# EAGLE design Maduino Zero SIM868 GPS Tracker v1.1 (EAGLE 6.1)
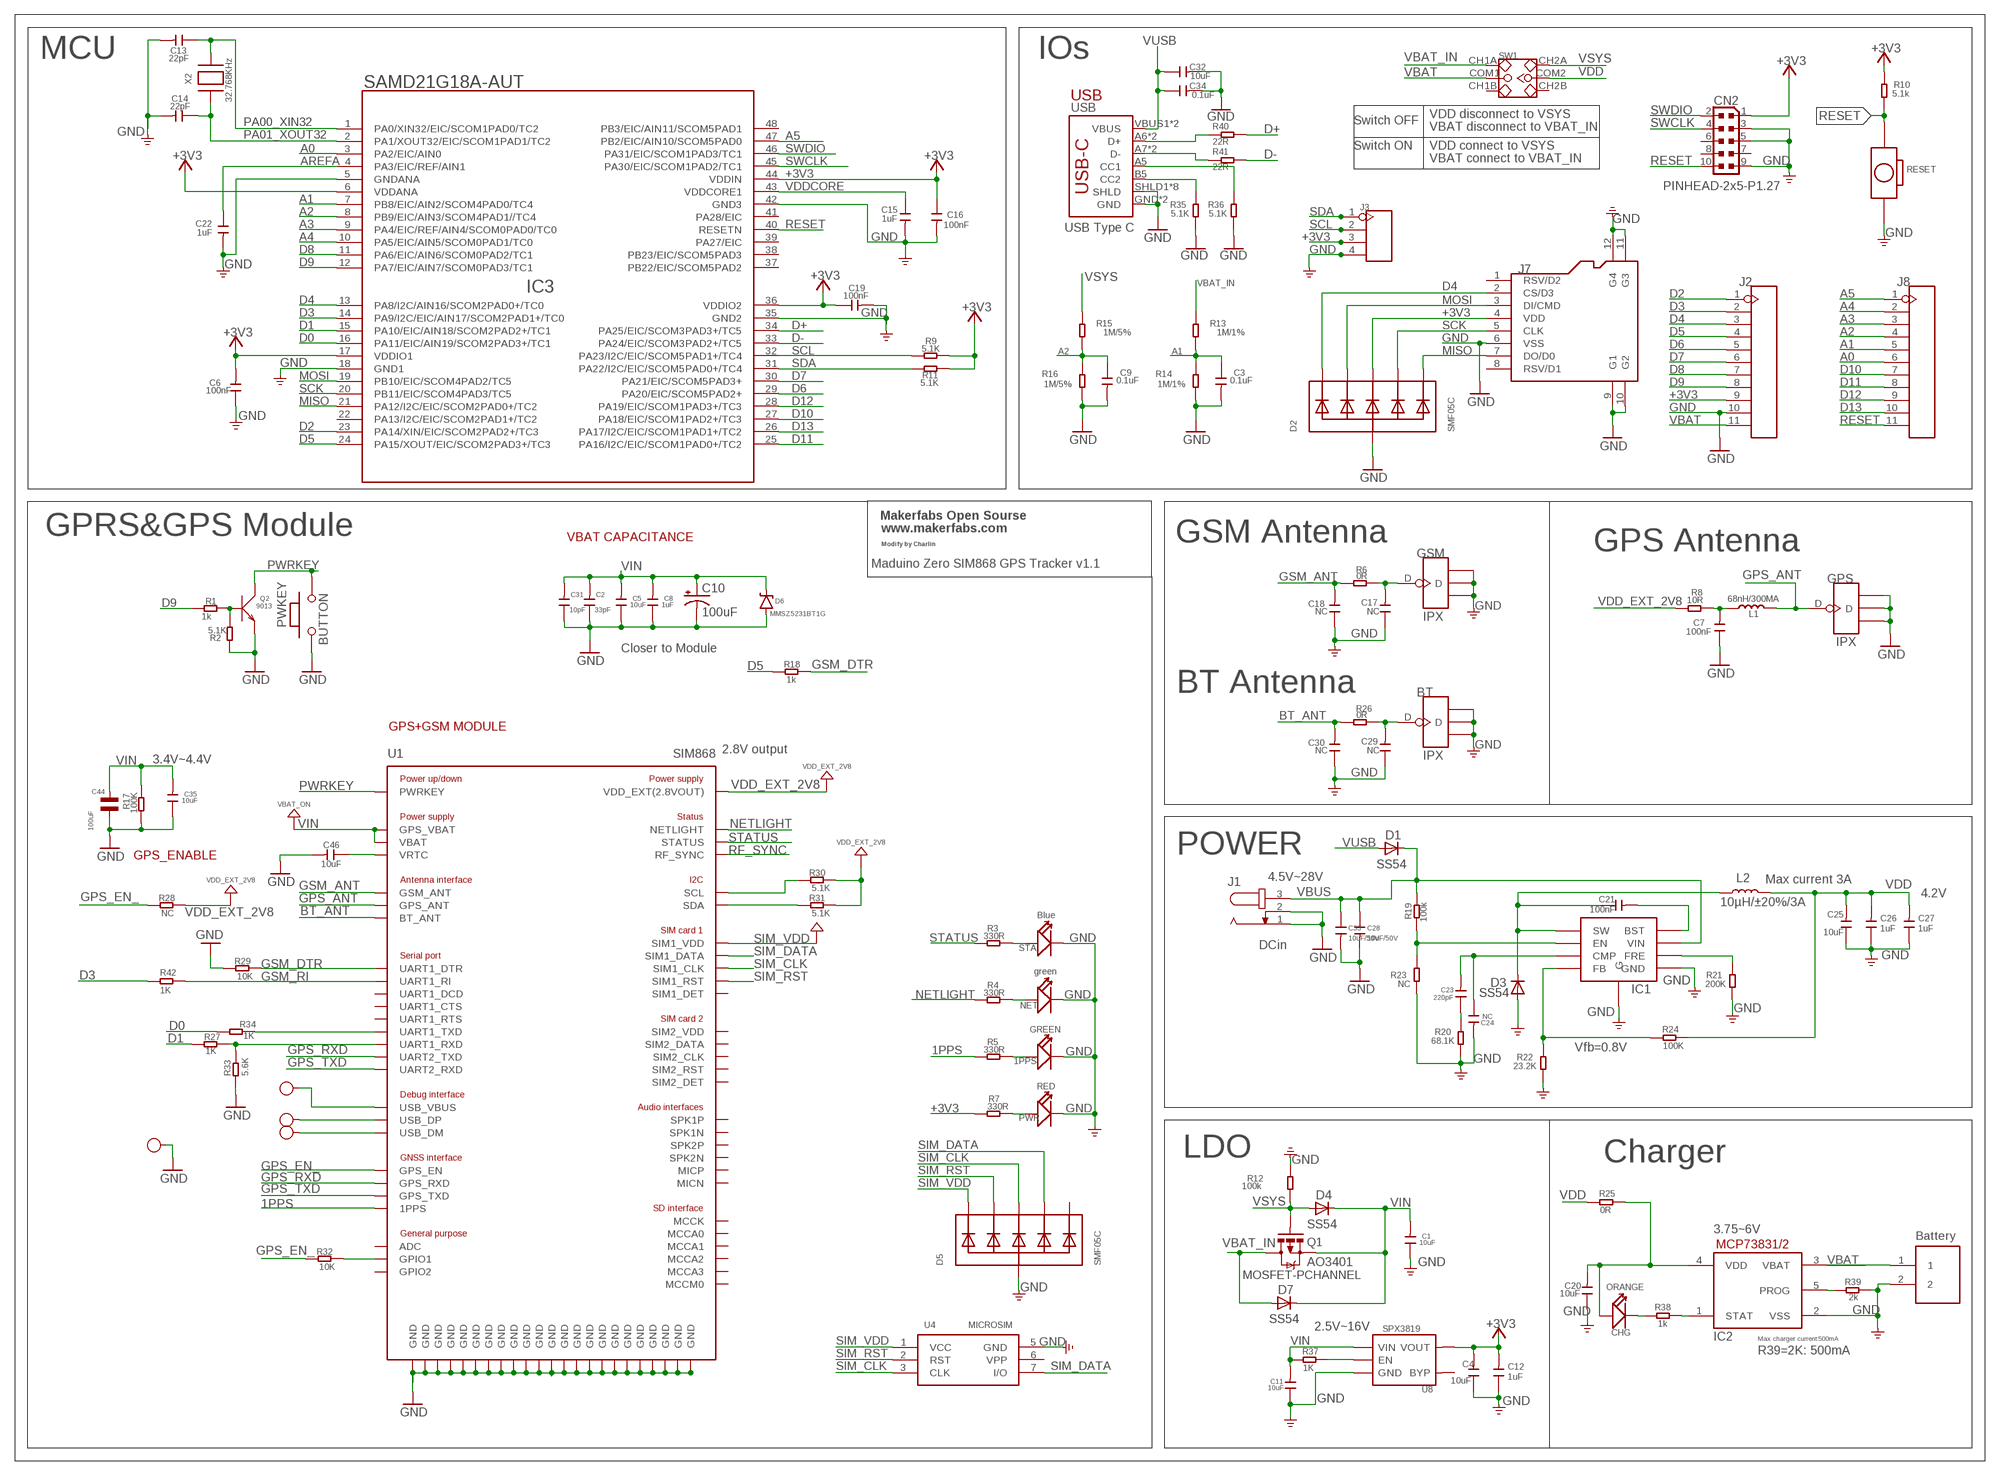
[diagram p0: schematic, sheet 1]

## Parts
1PPS  GREEN  LED'0603'  [LED-0603]
BT  ANTENNA-U-FL  [4P-U-FL]
C1  10uF  C-0603  [0603]
C2  33pF  C-0603  [0603]
C3  0.1uF  C-0603  [0603]
C4  10uF  C-0603  [0603]
C5  10uF  C-0603  [0603]
C6  100nF  C-0603  [0603]
C7  100nF  C-0603  [0603]
C8  1uF  C-0603  [0603]
C9  0.1uF  C-0603  [0603]
C10  100uF  68UF-POLAR-EIA3528-10V-10%(TANT)  [EIA3528]
C11  10uF  C-0603  [0603]
C12  1uF  C-0603  [0603]
C13  22pF  C-0603  [0603]
C14  22pF  C-0603  [0603]
C15  1uF  C-0603  [0603]
C16  100nF  C-0603  [0603]
C17  NC  C-0402  [0402]
C18  NC  C-0402  [0402]
C19  100nF  C-0603  [0603]
C20  10uF  C-0603  [0603]
C21  100nF  C-0603  [0603]
C22  1uF  C-0603  [0603]
C23  220pF  C-0603  [0603]
C24  NC  C-0603  [0603]
C25  10uF  C-0603  [0603]
C26  1uF  C-0603  [0603]
C27  1uF  C-0603  [0603]
C28  10uF/50V  C-0603  [0603]
C29  NC  C-0402  [0402]
C30  NC  C-0402  [0402]
C31  10pF  C-0603  [0603]
C32  10uF  C-0603  [0603]
C33  10uF/50V  C-0603  [0603]
C34  0.1uF  C-0603  [0603]
C35  10uF  C-0603  [0603]
C44  100uF  CAPACITOR_NP_1206  [C1206]
C46  10uF  C-0805  [0805]
CHG  ORANGE  007-LED0603  [D0603]
CN2  PINHEAD-2x5-P1.27  0171_PH127-205DF055G00AROUND-PADS  [PINHEAD_2X05_127]
D1  SS54  DIODE-DO-214AC  [DO-214AC]
D2  SMF05C  TVSARRAY_5LANE  [SOT363]
D3  SS54  DIODE-DO-214AC  [DO-214AC]
D4  SS54  DIODE-DO-214AC  [DO-214AC]
D5  SMF05C  TVSARRAY_5LANE  [SOT363]
D6  MMSZ5231BT1G  [SOD-123]
D7  SS54  DIODE-DO-214AC  [DO-214AC]
DN  TEST-POINT'4545'  [TP-D45MIL]
DP  TEST-POINT'4545'  [TP-D45MIL]
GND20  TEST-POINT'4545'  [TP-D45MIL]
GPS  ANTENNA-U-FL  [4P-U-FL]
GSM  ANTENNA-U-FL  [4P-U-FL]
IC1  MP1584  [SOIC8E]
IC2  MCP73831/OT  [SOT23-5L]
IC3  SAMD21G18A-AUT  ATSAMD21G18A-AUT  [TQFP48-7X7]
J1  JACK-PLUG1  [SPC4078]
J2  HEADER-11P-2.54  [11P-2.54]
J3  HEADER-4P-60/35MILROUND  [4P-65/35ROUND]
J6  PH2.0-2P-90-DIP  [PH2.0-2P-90-DIP]
J7  HOLDER-MICROSD-8P  [8P-SMD]
J8  HEADER-11P-2.54  [11P-2.54]
L1  68nH/300MA  L'0603'  [L0603]
L2  10µH/±20%/3A  INDUCTOR-SRN6045-33UH  [SRN6045]
NET  green  LED'0603'  [LED-0603]
PWKEY  BUTTON  PB157  [157SW]
PWR  RED  LED'0603'  [LED-0603]
Q1  MOSFET-PCHANNEL  [SOT23-3]
Q2  9013  TRANSISTOR-NPN-SOT23  [SOT23]
R1  1k  R-0603  [R0603]
R2  5.1K  R-0603  [R0603]
R3  330R  R-0603  [R0603]
R4  330R  R-0603  [R0603]
R5  330R  R-0603  [R0603]
R6  0R  R-0603  [R0603]
R7  330R  R-0603  [R0603]
R8  10R  R-0603  [R0603]
R9  5.1K  R-0603  [R0603]
R10  5.1k  R-0603  [R0603]
R11  5.1K  R-0603  [R0603]
R12  100k  R-0603  [R0603]
R13  1M/1%  R-0603  [R0603]
R14  1M/1%  R-0603  [R0603]
R15  1M/5%  R-0603  [R0603]
R16  1M/5%  R-0603  [R0603]
R17  100K  R-0603  [R0603]
R18  1k  R-0603  [R0603]
R19  100k  R-0603  [R0603]
R20  68.1K  R-0603  [R0603]
R21  200K  R-0603  [R0603]
R22  23.2K  R-0603  [R0603]
R23  NC  R-0603  [R0603]
R24  100K  R-0603  [R0603]
R25  0R  R-0603  [R0603]
R26  0R  R-0603  [R0603]
R27  1K  R-0603  [R0603]
R28  NC  R-0603  [R0603]
R29  10K  R-0603  [R0603]
R30  5.1K  R-0603  [R0603]
R31  5.1K  R-0603  [R0603]
R32  10K  R-0603  [R0603]
R33  5.6K  R-0603  [R0603]
R34  1K  R-0603  [R0603]
R35  5.1K  R-0603  [R0603]
R36  5.1K  R-0603  [R0603]
R37  1K  R-0603  [R0603]
R38  1k  R-0603  [R0603]
R39  2k  R-0603  [R0603]
R40  22R  R-0603  [R0603]
R41  22R  R-0603  [R0603]
R42  1K  R-0603  [R0603]
RESET  BOTTON-2P-90D  [2P-7.62X3.56-90D]
STA  Blue  LED'0603'  [LED-0603]
SW1  SWITCH-2CH-6P  [6P-2CH-2.54-7.6X3.0]
U1  SIM868  [SIM868]
U4  MICROSIM  [MICROSIM]
U8  SPX3819  [SOT23-5]
USB  USB_C5  [USB-C-16P-5]
VUSB  TEST-POINT'4545'  [TP-D45MIL]
X2  32.768KHz  XTAL-3.2X1.5  [XTAL3215]

## Nets
1PPS: R5.1 U1.60_(1PPS)
+3V3: C4.2 C6.2 C12.2 C16.1 C19.1 CN2.1 D2.4(C3) IC3.6(VDDANA) IC3.17(VDDIO1) IC3.36(VDDIO2) IC3.44(VDDIN) J2.9 J3.3 J7.4(VDD) R7.1 R9.2 R10.2 R11.2 U8.5(VOUT)
A0: IC3.3(PA2/EIC/AIN0) J8.6
A1: C3.1 IC3.7(PB8/EIC/AIN2/SCOM4PAD0/TC4) J8.5 R13.1 R14.2
A2: C9.1 IC3.8(PB9/EIC/AIN3/SCOM4PAD1//TC4) J8.4 R15.1 R16.2
A3: IC3.9(PA4/EIC/REF/AIN4/SCOM0PAD0/TC0) J8.3
A4: IC3.10(PA5/EIC/AIN5/SCOM0PAD1/TC0) J8.2
A5: IC3.47(PB2/EIC/AIN10/SCOM5PAD0) J8.1
AREFA: C22.1 IC3.4(PA3/EIC/REF/AIN1)
BT_ANT: C30.2 R26.1 U1.20_(BT_ANT)
D0: IC3.16(PA11/EIC/AIN19/SCOM2PAD3+/TC1) R34.1
D1: IC3.15(PA10/EIC/AIN18/SCOM2PAD2+/TC1) R27.1
D2: IC3.23(PA14/XIN/EIC/SCOM2PAD2+/TC3) J2.1
D3: IC3.14(PA9/I2C/EIC/AIN17/SCOM2PAD1+/TC0) J2.2 R42.1
D4: D2.1(C1) IC3.13(PA8/I2C/AIN16/SCOM2PAD0+/TC0) J2.3 J7.2(CS/D3)
D5: IC3.24(PA15/XOUT/EIC/SCOM2PAD3+/TC3) J2.4 R18.1
D6: IC3.29(PA20/EIC/SCOM5PAD2+) J2.5
D7: IC3.30(PA21/EIC/SCOM5PAD3+) J2.6
D8: IC3.11(PA6/EIC/AIN6/SCOM0PAD2/TC1) J2.7
D9: IC3.12(PA7/EIC/AIN7/SCOM0PAD3/TC1) J2.8 R1.1
D10: IC3.27(PA18/EIC/SCOM1PAD2+/TC3) J8.7
D11: IC3.25(PA16/I2C/EIC/SCOM1PAD0+/TC2) J8.8
D12: IC3.28(PA19/EIC/SCOM1PAD3+/TC3) J8.9
D13: IC3.26(PA17/I2C/EIC/SCOM1PAD1+/TC2) J8.10
D+: IC3.34(PA25/EIC/SCOM3PAD3+/TC5) R40.1
D-: IC3.33(PA24/EIC/SCOM3PAD2+/TC5) R41.1
GND: 1PPS.- BT.GND1 BT.GND2 BT.GND3 C1.1 C2.1 C3.2 C4.1 C5.1 C6.1 C7.1 C8.1 C9.2 C10.C(-) C11.1 C12.1 C13.2 C14.2 C15.2 C16.2 C17.1 C18.1 C19.2 C20.1 C22.2 C24.2 C25.1 C26.1 C27.1 C28.2 C29.1 C30.1 C31.1 C32.2 C33.2 C34.2 C35.1 C44.P$2 C46.2 CN2.3 CN2.5 CN2.9 D2.2(A) D3.A D5.2(A) D6.A GND20.T GPS.GND1 GPS.GND2 GPS.GND3 GSM.GND1 GSM.GND2 GSM.GND3 IC1.P$5(GND) IC1.P$9(G) IC2.2(VSS) IC3.5(GNDANA) IC3.18(GND1) IC3.35(GND2) IC3.42(GND3) J1.1 J1.2 J2.10 J3.4 J6.2 J7.6(VSS) J7.9(G1) J7.10(G2) J7.11(G3) J7.12(G4) NET.- PWKEY.1 PWR.- Q2.2(E) R2.2 R12.2 R14.1 R16.1 R17.1 R20.1 R21.1 R22.1 R23.1 R29.1 R33.1 R35.1 R36.1 R39.2 RESET.P$2 STA.- U1.8_(GND) U1.13_(GND) U1.19_(GND) U1.21_(GND) U1.27_(GND) U1.30_(GND) U1.31_(GND) U1.33_(GND) U1.36_(GND) U1.37_(GND) U1.45_(GND) U1.63_(GND) U1.66_(GND) U1.67_(GND) U1.69_(GND) U1.70_(GND) U1.71_(GND) U1.72_(GND) U1.73_(GND) U1.74_(GND) U1.75_(GND) U1.76_(GND) U1.77_(GND) U4.5(GND) U8.2(GND) USB.GND USB.GND2(GND) USB.SHLD1(SHLD) USB.SHLD2(SHLD) USB.SHLD3(SHLD) USB.SHLD4(SHLD) USB.SHLD5(SHLD) USB.SHLD6(SHLD) USB.SHLD7(SHLD) USB.SHLD8(SHLD)
GPS_ANT: GPS.D L1.2 U1.68_(GPS_ANT)
GPS_EN_: R28.1 R32.1 U1.59_(GPS_EN)
GPS_RXD: U1.22_(UART2_TXD) U1.62_(GPS_RXD)
GPS_TXD: U1.23_(UART2_RXD) U1.61_(GPS_TXD)
GSM_ANT: C18.2 R6.1 U1.32_(GSM_ANT)
GSM_DTR: R18.2 R29.2 U1.6_(UART1_DTR)
GSM_RI: R42.2 U1.7_(UART1_RI)
MISO: D2.6(C5) IC3.21(PA12/I2C/EIC/SCOM2PAD0+/TC2) J7.7(DO/D0)
MOSI: D2.3(C2) IC3.19(PB10/EIC/SCOM4PAD2/TC5) J7.3(DI/CMD)
N$1: NET.+ R4.2
N$2: 1PPS.+ R5.2
N$3: PWR.+ R7.2
N$4: R31.1 U1.64_(SDA)
N$5: C21.1 D3.C IC1.P$1(SW) L2.1
N$6: C21.2 IC1.P$8(BST)
N$7: R3.2 STA.+
N$8: C20.2 CHG.+ IC2.4(VDD) R25.2
N$9: IC1.P$4(FB) R22.2 R24.1
N$10: C23.2 C24.1 IC1.P$3(CMP)
N$11: C23.1 R20.2
N$12: BT.D C29.2 R26.2
N$13: IC1.P$6(FRE) R21.2
N$14: IC1.P$2(EN) R19.1 R23.2
N$16: R30.1 U1.65_(SCL)
N$17: R27.2 R33.2 U1.2_(UART1_RXD)
N$18: R34.2 U1.1_(UART1_TXD)
N$19: R32.2 U1.57_(GPIO1)
N$20: U1.24_(USB_VBUS) VUSB.T
N$21: C7.2 L1.1 R8.2
N$22: DP.T U1.25_(USB_DP)
N$23: DN.T U1.26_(USB_DM)
N$24: R37.2 U8.3(EN)
N$25: CHG.- R38.1
N$26: IC2.1(STAT) R38.2
N$27: R36.2 USB.A5(CC1)
N$28: R35.2 USB.B5(CC2)
N$29: C46.1 U1.28_(VRTC)
N$31: IC2.5(PROG) R39.1
N$32: R40.2 USB.A6(D+) USB.B6(D+)
N$33: R41.2 USB.A7(D-) USB.B7(D-)
N$36: Q2.1(B) R1.2 R2.1
N$94: C17.2 GSM.D R6.2
NETLIGHT: R4.1 U1.41_(NETLIGHT)
P$1: R30.2 R31.2 ; supply symbol labelled VDD_EXT_2V8
PA00_XIN32: C13.1 IC3.1(PA0/XIN32/EIC/SCOM1PAD0/TC2) X2.P$2
PA01_XOUT32: C14.1 IC3.2(PA1/XOUT32/EIC/SCOM1PAD1/TC2) X2.P$1
PWRKEY: PWKEY.2 Q2.3(C) U1.39_(PWRKEY)
RESET: CN2.10 IC3.40(RESETN) J8.11 R10.1 RESET.P$1
RF_SYNC: U1.29_(RF_SYNC)
SCK: D2.5(C4) IC3.20(PB11/EIC/SCOM4PAD3/TC5) J7.5(CLK)
SCL: IC3.32(PA23/I2C/EIC/SCOM5PAD1+/TC4) J3.2 R9.1
SDA: IC3.31(PA22/I2C/EIC/SCOM5PAD0+/TC4) J3.1 R11.1
SIM_CLK: D5.4(C3) U1.16_(SIM1_CLK) U4.3(CLK)
SIM_DATA: D5.5(C4) U1.15_(SIM1_DATA) U4.7(I/O)
SIM_RST: D5.3(C2) U1.17_(SIM1_RST) U4.2(RST)
SIM_VDD: D5.1(C1) U1.18_(SIM1_VDD) U4.1(VCC)
STATUS: R3.1 U1.42_(STATUS)
SWCLK: CN2.4 IC3.45(PA30/EIC/SCOM1PAD2/TC1)
SWDIO: CN2.2 IC3.46(PA31/EIC/SCOM1PAD3/TC1)
VBAT: IC2.3(VBAT) J2.11 J6.1 SW1.COM1
VBAT_IN: D7.A Q1.3(D) R13.2 SW1.CH1A
VBUS: C28.1 C33.1 D1.C IC1.P$7(VIN) J1.3 R19.2
VDD: C25.2 C26.2 C27.2 L2.2 R24.2 R25.1 SW1.COM2
VDD_EXT_2V8: R8.1 R28.2 U1.40_(VDD_EXT(2.8VOUT))
VDDCORE: C15.1 IC3.43(VDDCORE1)
VIN: C1.2 C2.2 C5.2 C8.2 C10.A(+) C11.2 C31.2 C35.2 C44.P$1 D4.C D6.C D7.C Q1.2(S) R17.2 R37.1 U1.34_(GPS_VBAT) U1.35_(VBAT) U8.1(VIN) ; supply symbol labelled VBAT_ON
VSYS: D4.A Q1.1(G) R12.1 R15.2 SW1.CH2A
VUSB: C32.1 C34.1 D1.A USB.VBUS1(VBUS) USB.VBUS2(VBUS)
Unconnected: CN2.6 CN2.7 CN2.8 D5.6(C5) IC3.22(PA13/I2C/EIC/SCOM2PAD1+/TC2) IC3.37(PB22/EIC/SCOM5PAD2) IC3.38(PB23/EIC/SCOM5PAD3) IC3.39(PA27/EIC) IC3.41(PA28/EIC) IC3.48(PB3/EIC/AIN11/SCOM5PAD1) J7.1(RSV/D2) J7.8(RSV/D1) SW1.CH1B SW1.CH2B U1.3_(UART1_RTS) U1.4_(UART1_CTS) U1.5_(UART1_DCD) U1.9_(MICP) U1.10_(MICN) U1.11_(SPK1P) U1.12_(SPK1N) U1.14_(SIM1_DET) U1.38_(ADC) U1.43_(SPK2N) U1.44_(SPK2P) U1.46_(MCCA3) U1.47_(MCCA2) U1.48_(MCCA1) U1.49_(MCCA0) U1.50_(MCCK) U1.51_(MCCM0) U1.52_(SIM2_DET) U1.53_(SIM2_DATA) U1.54_(SIM2_CLK) U1.55_(SIM2_RST) U1.58_(GPIO2) U4.6(VPP) U8.4(BYP)

## Notes on the sheet
- MCU | IOs
- USB
- VDD disconnect to VSYS
- Switch OFF
- VBAT disconnect to VBAT_IN
- Switch ON | VDD connect to VSYS
- VBAT connect to VBAT_IN
- USB Type C
- Makerfabs Open Sourse
- GPRS&GPS Module | www.makerfabs.com
- VBAT CAPACITANCE | GSM Antenna
- Modify by Charlin
- GPS Antenna
- Maduino Zero SIM868 GPS Tracker v1.1
- IPX
- IPX
- Closer to Module
- BT Antenna
- GPS+GSM MODULE
- 2.8V output
- IPX
- 3.4V~4.4V
- POWER
- GPS_ENABLE
- 4.5V~28V | Max current 3A
- 4.2V
- DCin
- Vfb=0.8V
- Charger
- LDO
- 3.75~6V
- Battery
- AO3401
- 2.5V~16V
- Max charger current:500mA
- R39=2K: 500mA

## Power pins joined to a net without a drawn wire
SIM2_VDD: U1.56_(SIM2_VDD)

## Library data of the parts
1PPS NET PWR STA = Discrete:LED*
BT GPS GSM = Connector:ANTENNA-U-FL
C1-C9 C11-C35 C46 = Discrete:C*: Ceramic Capacitors
C10 = SparkFun-Capacitors:68UF-POLAR: 68µF polarized capacitors A capacitor is a passive two-terminal electrical component used to store electrical energy temporarily in an electric field.; PROD_ID: CAP-10790; VALUE: 68uF
C44 = MF_Passives:CAPACITOR_NP: Library: MF_Passives Description: Device for Non-Polarized Capacitors. Manufacture part number (MPN) can be added via Attributes. Check https://factory.macrofab.com/parts for the house parts list.; MPN: CL31A107MQHNNNE; POPULATE: 1
CHG = Discrete:007-LED*
CN2 = Connettori:0171_PH127-205DF055G00A: 2x5 PASSO 1,27
D1 D3 D4 D7 = diode:DIODE-: DIODE
D2 D5 = microbuilder:TVSARRAY_5LANE: Voltage Transient Suppressor Array SOT363 SMF05C - 100W 5V: Digikey - SMF05CT1GOSCT-ND
D6 = Deegou-Diodes:MMSZ5231BT1G: DIODE ZENER 5.1V 500MW SOD123; MFR: ON SEMICONDUCTOR; MPN: MMSZ5231BT1G
DN DP GND20 VUSB = Discrete-new:TEST-POINT; PARTNO: DNP
IC1 = IC:MP1584
IC2 = adafruit:MCP73831: MCP73831/2 Miniature Single-Cell, Fully Integrated Li-Ion, Li-Polymer Charge Management Controllers. Nice and small simple lipoly charge controller, with adjustable current and status output (LED) http://www.ladyada.net/library/pcb/eaglelibrary.html
IC3 = IC:ATSAMD21G18A-AUT: Atmel D21 32bit ARM Cortex-M0 microcontroller - 48 PIN TQFP 256KB flash memory + 32KB SRAM
J1 = con-jack:JACK-PLUG: DC POWER JACK Power Jack, DC, Right Angle, Through Hole, Rated 5A at 16VDC, PC Terminals Distributor: Farnell (www.Farnell.de) Drawing: 84N1161.pdf / 84N1162.pdf Manufacturer: SPC Technology (www.spctechnology.com) Type: SPC4077 / SPC 4078; OC_FARNELL: unknown; OC_NEWARK: unknown
J2 J8 = Connector:HEADER-11P
J3 = Connector:HEADER-4P
J6 = Connector:PH2.0-2P-90-DIP
J7 = Connector:HOLDER-MICROSD-8P
L1 = Discrete:L*
L2 = SparkFun-Coils:INDUCTOR: Inductors Resist changes in electrical current. Basically a coil of wire. SparkFun Products: SparkFun Load Cell Amplifier - HX711 <https://www.sparkfun.com/products/13879> IOIO-OTG - V2.2 <https://www.sparkfun.com/products/13613>; PROD_ID: NDUC-11627; VALUE: 33µH/±20%/1.4A
PWKEY = MySMD:PB157
Q1 = User-Submitted:MOSFET-PCHANNEL: Generic PMOSFET IRLML2244 - TRANS-11153 (SOT-23 -20V -4.3A) (1.Gate 2.Source 3.Drain) FQP27P06 - COM-10349 <http://www.sparkfun.com/products/10349> (TO-220 -60V -27A) (1.Gate 2.Source 3.Drain); PROD_ID: TRANS-08285
Q2 = Discrete:TRANSISTOR-NPN*: NPN audion
R1-R42 = Discrete:R*
RESET = Discrete:BOTTON-2P
SW1 = Discrete:SWITCH-2CH-6P
U1 = SIM868:SIM868; CONSIGN: 1; MPN: SIM868
U4 = Connector:MICROSIM
U8 = IC:SPX3819
USB = USBC:USB_C: USB Type C 16Pin Connector Super Speed pins not available on the 16-pin purely SMD connector so this part is best for USB 2.0 implementations. D1 and D2 are tied together enabling D+/- no matter which way the cable is plugged into the connector. The two channel configuration pins (CC1/2) are exposed. These are normally connected to ground via 5.1k resistors but can be reconfigured for high current/high power applications.
X2 = adafruit2:XTAL: Low cost SMT crystals, no capacitors included http://www.ladyada.net/library/eagle

## Net classes
0 default: width 0.203 mm
2 gnd: width 0.305 mm, drill 0.559 mm, clearance 0.254 mm
3 usbvcc: width 0.508 mm, drill 0.61 mm, clearance 0.254 mm
4 USBpair: width 0.254 mm, drill 0.406 mm, clearance 0.406 mm

## Board
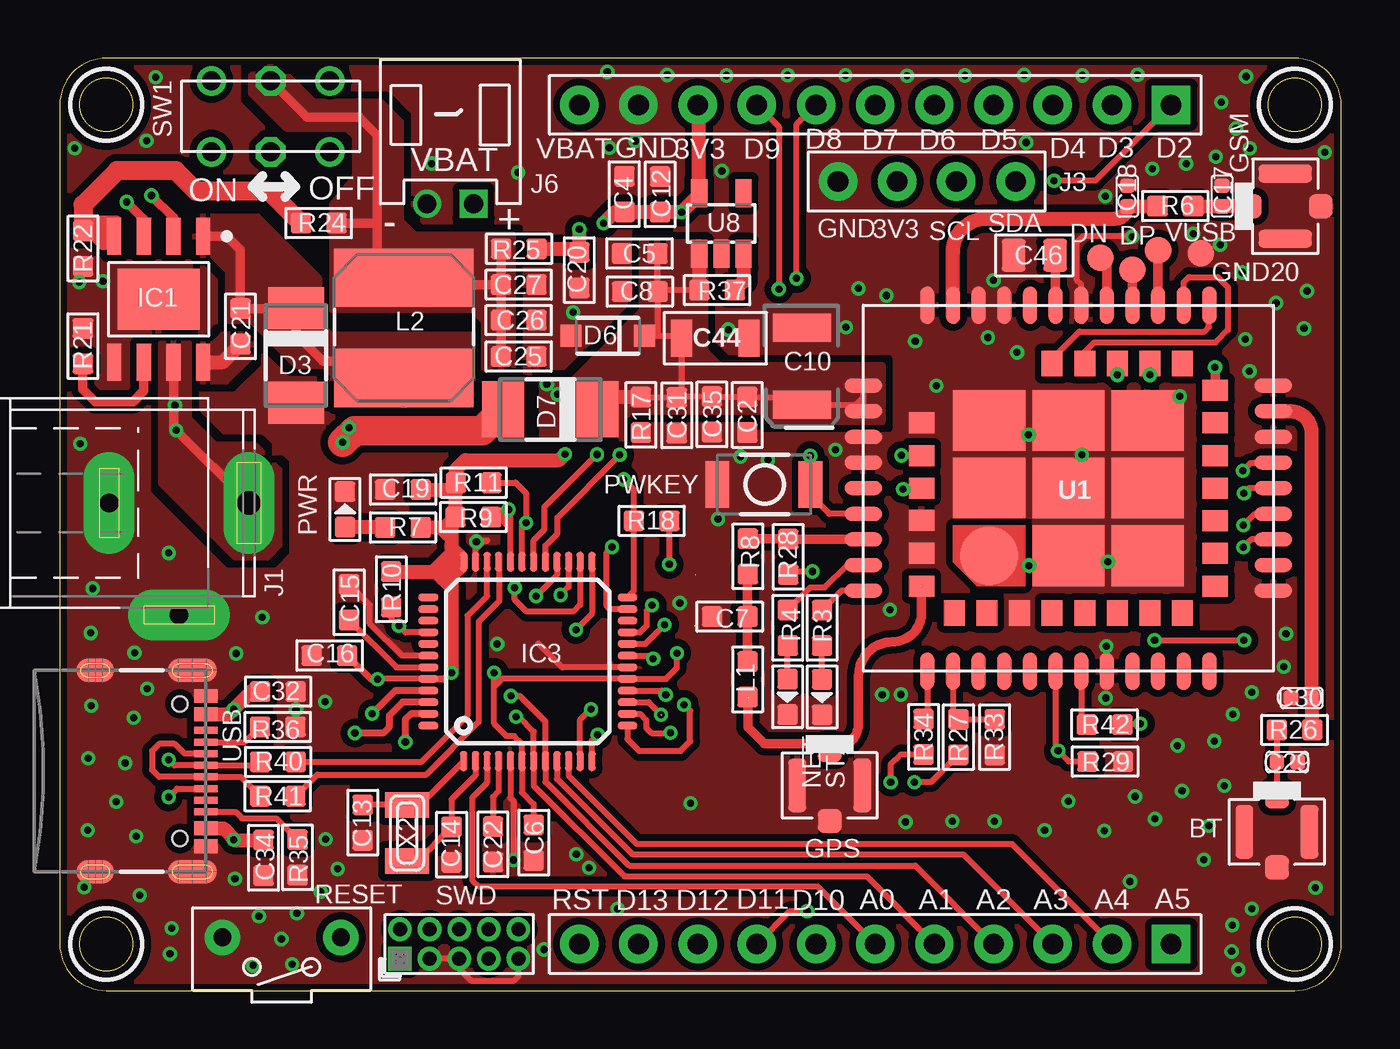
[diagram p1: board, top side]
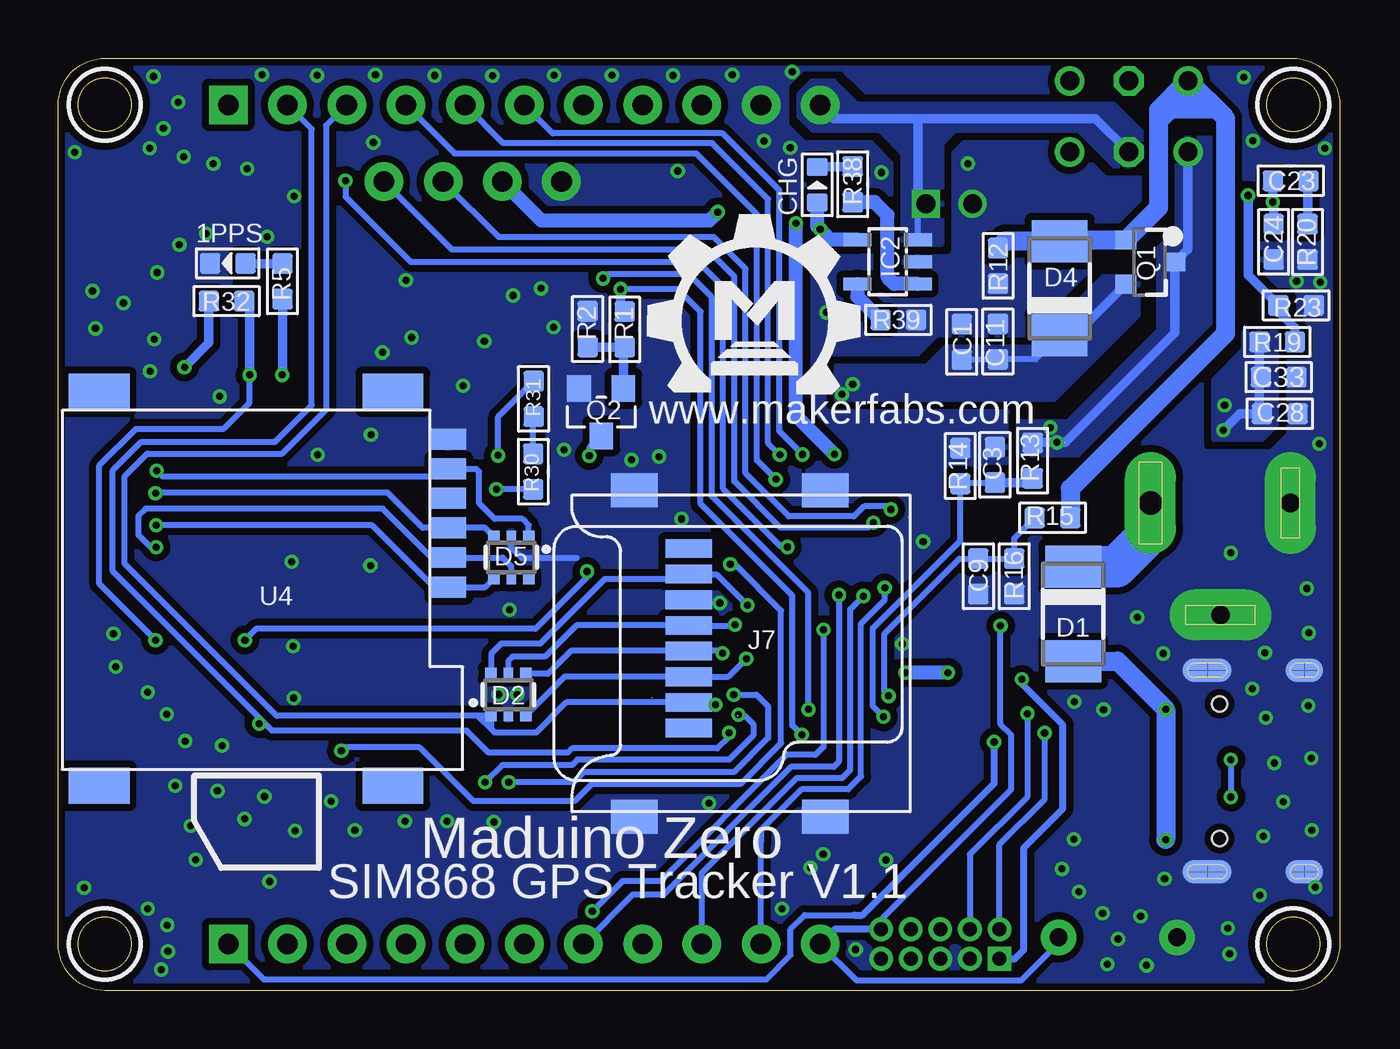
[diagram p2: board, bottom side, seen from below]

Size 55 x 40 mm. Coordinates in mm from the lower left corner, seen from the top.
Outline: 0,38 0,2 arc90 2,0 53,0 arc90 55,2 55,38 arc90 53,40 2,40 arc90 0,38
Outline: circle at 53,2 radius 1.14
Outline: circle at 53,38 radius 1.14
Outline: circle at 2,2 radius 1.14
Outline: circle at 2,38 radius 1.14
Copper layers (1*16): Top 0.035mm / dielectric 1.5mm / Bottom 0.035mm
Design rules: minimum track width 6mil, minimum drill 8mil, track to track 6mil, track to pad 6mil, pad to pad 6mil, via to via 6mil, smd to smd 0mil, copper to edge 10mil, drill to drill 10mil, minimum pad ring 8mil, minimum via ring 6mil, stop-mask expansion 2mil, vias tented up to drill 100mil, thermal gap 0mil
tRestrict: area 51.5,0.5 to 54.5,3.5; area 51.5,36.5 to 54.5,39.5; area 0.5,0.5 to 3.5,3.5; area 0.5,36.5 to 3.5,39.5
bRestrict: area 51.5,0.5 to 54.5,3.5; area 51.5,36.5 to 54.5,39.5; area 0.5,0.5 to 3.5,3.5; area 0.5,36.5 to 3.5,39.5

### Footprints (pad centres in the part's own frame; a part is rotated, then mirrored left to right if it is on the bottom)
LED-0603 = smd 0.889 x 0.889: + -0.762,0; - 0.762,0
4P-U-FL = smd 1.016 x 1.016: D -1.524,0; GND3 1.524,0 | smd 2.286 x 0.762: GND1 0,1.397; GND2 0,-1.397
0603 = smd 0.889 x 0.889: 1 -0.762,0; 2 0.762,0
EIA3528 = smd 1.2 x 2.5: A 1.65,0; C -1.65,0
0402 = smd 0.635 x 0.635: 1 -0.445,0; 2 0.445,0
C1206 = smd 0.9 x 1.6: P$1 -1.45,0; P$2 1.45,0
0805 = smd 1.016 x 1.397: 1 -0.889,0; 2 0.889,0
D0603 = smd 0.762 x 0.889: + -0.762,0; - 0.762,0
PINHEAD_2X05_127 = drill 0.6 pad 1.016 square: 1 -0.635,2.54 | drill 0.6 pad 1.016: 2 0.635,2.54; 3 -0.635,1.27; 4 0.635,1.27; 5 -0.635,0; 6 0.635,0; 7 -0.635,-1.27; 8 0.635,-1.27; 9 -0.635,-2.54; 10 0.635,-2.54
DO-214AC = smd 1.8 x 2.4: A 2.025,0; C -2.025,0
SOT363 = smd 0.5 x 0.5: 1 -0.75,-0.9; 3 0.75,-0.9; 4 0.75,0.9; 6 -0.75,0.9 | smd 0.4 x 0.5: 2 0,-0.9; 5 0,0.9
SOD-123 = smd 0.9 x 0.95: A 1.575,0; C -1.575,0
TP-D45MIL = smd 1.143 x 1.143: T 0,0
SOIC8E = smd 1.6 x 0.61: P$1 0,3.81; P$2 0,2.54; P$3 0,1.27; P$4 0,0; P$5 5.4,0; P$6 5.4,1.27; P$7 5.4,2.54; P$8 5.4,3.81 | smd 2.62 x 3.51: P$9 2.7,1.905
SOT23-5L = smd 0.55 x 1.2: 1 -0.95,-1.3; 2 0,-1.3; 3 0.95,-1.3; 4 0.95,1.3; 5 -0.95,1.3
TQFP48-7X7 = smd 0.85 x 0.32: 1 -4.275,2.75; 2 -4.275,2.25; 3 -4.275,1.75; 4 -4.275,1.25; 5 -4.275,0.75; 6 -4.275,0.25; 7 -4.275,-0.25; 8 -4.275,-0.75; 9 -4.275,-1.25; 10 -4.275,-1.75; 11 -4.275,-2.25; 12 -4.275,-2.75; 25 4.275,-2.75; 26 4.275,-2.25; 27 4.275,-1.75; 28 4.275,-1.25; 29 4.275,-0.75; 30 4.275,-0.25; 31 4.275,0.25; 32 4.275,0.75; 33 4.275,1.25; 34 4.275,1.75; 35 4.275,2.25; 36 4.275,2.75 | smd 0.32 x 0.85: 13 -2.75,-4.275; 14 -2.25,-4.275; 15 -1.75,-4.275; 16 -1.25,-4.275; 17 -0.75,-4.275; 18 -0.25,-4.275; 19 0.25,-4.275; 20 0.75,-4.275; 21 1.25,-4.275; 22 1.75,-4.275; 23 2.25,-4.275; 24 2.75,-4.275; 37 2.75,4.275; 38 2.25,4.275; 39 1.75,4.275; 40 1.25,4.275; 41 0.75,4.275; 42 0.25,4.275; 43 -0.25,4.275; 44 -0.75,4.275; 45 -1.25,4.275; 46 -1.75,4.275; 47 -2.25,4.275; 48 -2.75,4.275
SPC4078 = drill 0.8 pad 2.184 long: 1 -3,0; 2 0,-4.8 | drill 1 pad 2.184 long: 3 3,0
11P-2.54 = drill 0.889 pad 1.651 square: 1 0,12.7 | drill 0.889 pad 1.651: 2 0,10.16; 3 0,7.62; 4 0,5.08; 5 0,2.54; 6 0,0; 7 0,-2.54; 8 0,-5.08; 9 0,-7.62; 10 0,-10.16; 11 0,-12.7
4P-65/35ROUND = drill 0.889 pad 1.651: 1 0,3.81; 2 0,1.27; 3 0,-1.27; 4 0,-3.81
PH2.0-2P-90-DIP = drill 0.8 square: 1 0,1 | drill 0.8: 2 0,-1
8P-SMD = smd 0.8 x 2.008: 1 -3.198,0.254; 2 -2.098,0.254; 3 -0.998,0.254; 4 0.102,0.254; 5 1.202,0.254; 6 2.302,0.254; 7 3.402,0.254; 8 4.502,0.254 | smd 1.45 x 2: 9 -7.002,2.6; 10 7.002,2.6; 11 -7.002,-5.598; 12 7.002,-5.598
L0603 = smd 0.889 x 0.889: 1 -0.762,0; 2 0.762,0
SRN6045 = smd 2.5 x 6: 1 -2.175,0; 2 2.125,0
157SW = smd 1.016 x 1.981: 1 0,0; 2 4,0
SOT23-3 = smd 0.8 x 0.9: 1 -0.95,-1; 2 0.95,-1; 3 0,1.1
SOT23 = smd 1.016 x 1.143: 1 -0.95,-1.016; 2 0.95,-1.016; 3 0,1.016
R0603 = smd 0.889 x 0.889: 1 -0.762,0; 2 0.762,0
2P-7.62X3.56-90D = drill 0.762 pad 1.524: P$1 0,2.54; P$2 0,-2.54
6P-2CH-2.54-7.6X3.0 = drill 0.813 pad 1.27: CH1A -1.524,2.54; CH1B -1.524,-2.54; CH2A 1.524,2.54; CH2B 1.524,-2.54 | drill 0.813 pad 1.27 octagon: COM1 -1.524,0; COM2 1.524,0
SIM868 = smd 1.6 x 0.6: 1_ -7.85,6.05; 2_ -7.85,4.95; 3_ -7.85,3.85; 4_ -7.85,2.75; 5_ -7.85,1.65; 6_ -7.85,0.55; 7_ -7.85,-0.55; 8_ -7.85,-1.65; 9_ -7.85,-2.75; 10_ -7.85,-3.85; 11_ -7.85,-4.95; 12_ -7.85,-6.05; 22_ 7.85,-6.05; 23_ 7.85,-4.95; 24_ 7.85,-3.85; 25_ 7.85,-2.75; 26_ 7.85,-1.65; 27_ 7.85,-0.55; 28_ 7.85,0.55; 29_ 7.85,1.65; 30_ 7.85,2.75; 31_ 7.85,3.85; 32_ 7.85,4.95; 33_ 7.85,6.05 | smd 0.6 x 1.6: 13_ -4.4,-8.8; 14_ -3.3,-8.8; 15_ -2.2,-8.8; 16_ -1.1,-8.8; 17_ 0,-8.8; 18_ 1.1,-8.8; 19_ 2.2,-8.8; 20_ 3.3,-8.8; 21_ 4.4,-8.8; 34_ 4.4,8.8; 35_ 3.3,8.8; 36_ 2.2,8.8; 37_ 1.1,8.8; 38_ 0,8.8; 39_ -1.1,8.8; 40_ -2.2,8.8; 41_ -3.3,8.8; 42_ -4.4,8.8 | smd 1.1 x 0.9: 43_ -5.35,4.9; 44_ -5.35,3.5; 45_ -5.35,2.1; 46_ -5.35,0.7; 47_ -5.35,-0.7; 48_ -5.35,-2.1; 49_ -5.35,-3.5; 50_ -5.35,-4.9; 58_ 5.35,-4.9; 59_ 5.35,-3.5; 60_ 5.35,-2.1; 61_ 5.35,-0.7; 62_ 5.35,0.7 | smd 0.9 x 1.1: 51_ -4.2,-6.3; 52_ -2.8,-6.3; 53_ -1.4,-6.3; 54_ 0,-6.3; 55_ 1.4,-6.3; 56_ 2.8,-6.3; 57_ 4.2,-6.3; 63_ 2.8,6.3; 64_ 1.4,6.3; 65_ 0,6.3; 66_ -1.38,6.3; 67_ -2.8,6.3; 68_ -4.2,6.3 | smd 2.5 x 2.5: 69_ -2.9,3.4 | smd 2.6 x 3.1: 70_ -2.9,0; 71_ -2.9,-3.4; 72_ 0,-3.4; 73_ 2.9,-3.4; 74_ 2.9,0; 75_ 2.9,3.4; 76_ 0,3.4; 77_ 0,0
MICROSIM = smd 1.5 x 0.9: 1 -0.8,2.5; 2 -0.8,5.04; 3 -0.8,7.58; 5 -0.8,1.23; 6 -0.8,3.77; 7 -0.8,6.31 | smd 2.61 x 1.56: P$1 1.6,-0.8; P$2 14.2,-0.8; P$3 14.2,16.1; P$4 1.6,16.1
SOT23-5 = smd 0.69 x 1.2: 1 -0.95,-1.3; 2 0,-1.3; 3 0.95,-1.3; 4 0.95,1.3; 5 -0.95,1.3
USB-C-16P-5 = smd 0.3 x 1: A5 -1.25,-0.34; A6 -0.25,-0.34; A7 0.25,-0.34; A8 1.25,-0.34; B5 1.75,-0.34; B6 0.75,-0.34; B7 -0.75,-0.34; B8 -1.75,-0.34 | smd 0.6 x 1: GND -3.225,-0.34; GND2 3.225,-0.34; VBUS1 -2.45,-0.34; VBUS2 2.45,-0.34 | smd 1 x 2.1: SHLD1 -4.32,-0.915; SHLD2 4.32,-0.915 | smd 1 x 2.1 bottom: SHLD3 -4.32,-0.915; SHLD4 4.32,-0.915 | smd 1 x 1.6: SHLD5 -4.32,-5.095; SHLD8 4.32,-5.095 | smd 1 x 1.6 bottom: SHLD6 -4.32,-5.095; SHLD7 4.32,-5.095 | hole 0.65: -2.89,-1.445; 2.89,-1.445
XTAL3215 = smd 1.1 x 1.9: P$1 1.2,0; P$2 -1.2,0

### Placement (x,y rotation side)
1PPS  47.73,31.2 180 bottom
BT  52.24,6.81 270 top
C1  16.22,27.83 270 bottom
C2  29.51,24.7 90 top
C3  14.8,22.56 90 bottom
C4  24.23,34.17 270 top
C5  24.89,31.62 0 top
C6  20.35,6.35 90 top
C7  28.76,16.05 0 top
C8  24.9,29.99 0 top
C9  15.51,17.78 270 bottom
C10  31.85,26.78 270 top
C11  14.67,27.85 270 bottom
C12  25.77,34.16 270 top
C13  13.01,7.21 270 top
C14  16.82,6.27 270 top
C15  12.42,16.66 90 top
C16  11.58,14.38 180 top
C17  49.89,34.09 270 top
C18  45.82,34.09 270 top
C19  14.74,21.5 180 top
C20  22.3,30.91 90 top
C21  7.76,28.5 270 top
C22  18.59,6.27 270 top
C23  2.11,34.74 180 bottom
C24  2.84,32.12 270 bottom
C25  19.7,27.2 180 top
C26  19.7,28.77 180 top
C27  19.7,30.29 180 top
C28  2.58,24.75 0 bottom
C29  52.68,9.8 180 top
C30  53.29,12.55 0 top
C31  26.48,24.68 90 top
C32  9.37,12.83 0 top
C33  2.63,26.32 0 bottom
C34  8.75,5.7 270 top
C35  27.99,24.72 90 top
C44  28.14,27.98 0 top
C46  41.83,31.55 180 top
CHG  22.43,34.57 90 bottom
CN2  17.14,2 90 top
D1  11.44,16.16 270 bottom
D2  35.69,12.7 0 bottom
D3  10.14,27.25 270 top
D4  12.02,30.13 90 bottom
D5  35.56,18.58 180 bottom
D6  23.53,28.09 180 top
D7  21.06,24.94 180 top
DN  44.66,31.45 90 top
DP  46.04,30.93 90 top
GND20  48.97,31.64 90 top
GPS  33.05,8.8 270 top
GSM  52.6,33.65 0 top
IC1  2.34,32.36 270 top
IC2  19.41,31.27 90 bottom
IC3  20.09,14.12 90 top
J1  5.12,20.92 0 top
J2  35,38 270 top
J3  37.21,34.71 270 top
J6  16.76,33.76 270 top
J7  27.69,14.47 90 bottom
J8  35,2 270 top
L1  29.53,13.35 270 top
L2  14.77,28.46 90 top
NET  31.24,12.6 270 top
PWKEY  28.22,21.72 0 top
PWR  12.24,20.64 90 top
Q1  8.17,31.25 270 bottom
Q2  31.7,24.82 180 bottom
R1  30.69,28.37 270 bottom
R2  32.28,28.38 90 bottom
R3  32.72,15.56 270 top
R4  31.25,15.57 270 top
R5  45.38,30.43 90 bottom
R6  47.88,33.66 0 top
R7  14.73,19.87 180 top
R8  29.53,18.63 270 top
R9  17.75,20.31 180 top
R10  14.23,17.22 90 top
R11  17.77,21.79 180 top
R12  14.67,31.09 270 bottom
R13  13.18,22.74 90 bottom
R14  16.29,22.51 270 bottom
R15  12.33,20.29 0 bottom
R16  13.97,17.78 90 bottom
R17  24.94,24.7 90 top
R18  25.4,20.15 0 top
R19  2.69,27.83 180 bottom
R20  1.38,32.12 90 bottom
R21  1,27.65 270 top
R22  1,31.84 90 top
R23  1.88,29.4 180 bottom
R24  11.11,32.93 0 top
R25  19.71,31.83 0 top
R26  52.99,11.19 180 top
R27  38.57,10.88 90 top
R28  31.27,18.61 90 top
R29  44.87,9.83 180 top
R30  34.62,22.27 90 bottom
R31  34.6,25.39 270 bottom
R32  47.78,29.58 180 bottom
R33  40.13,10.87 90 top
R34  37.08,10.89 90 top
R35  10.21,5.72 90 top
R36  9.36,11.32 180 top
R37  28.21,30.05 0 top
R38  20.9,34.59 270 bottom
R39  18.95,28.78 0 bottom
R40  9.37,9.81 180 top
R41  9.36,8.34 180 top
R42  44.84,11.42 180 top
RESET  9.53,2.29 270 top
STA  32.72,12.59 270 top
SW1  9.05,37.51 90 top
U1  43.29,21.56 90 top
U4  39.04,24.89 180 bottom
U8  28.4,32.91 0 top
U$1  [MAKERFABS_0.3]  29.24,25.67 0 bottom
USB  6.61,9.42 270 top
VUSB  47.14,31.77 90 top
X2  14.91,6.76 270 top

### Tracks (layer width: path | path; a pad name or v marks a point on that pad's centre or on a via)
1PPS  (via drill 0.3)
  Top 0.406: v45.39,26.42 U1.60_
  Bottom 0.406: R5.1 45.38,26.43 v45.39,26.42
+3V3  (via drill 0.3)
  Top 0.254: 16.82,16.61 v16.82,13.64 | 18.64,13.03 18.64,11.46 19.18,10.92 19.51,10.92 19.84,10.59 IC3.6 19.84,8.51 20.34,8 C6.2 | 18.64,13.03 v18.64,13.64 18.91,13.37 IC3.17 26.02,13.37 26.49,13.84 v26.49,14.48 | IC3.36 17.32,18.41 16.82,18.41 | IC3.44 13.65,13.37 v13.64,13.36 | 15.88,18.06 16.51,18.69 17.37,18.69 17.37,18.67 | 17.37,18.49 17.37,18.11 16.97,17.7 16.97,17.07 16.82,17.07 15.93,17.96 15.93,18.11 16.84,19.02 | 17.37,18.67 16.97,19.07 16.89,19.07 16.84,19.02 | 17.37,18.67 17.37,18.49 | 17.37,18.49 17.17,18.29 | 17.17,18.29 17.17,17.98 | 17.17,18.29 17.17,18.54 17.09,18.47 16.48,18.47 16.43,18.41 16.43,17.6 16.33,17.7 16.33,18.26 | 18.64,13.03 18.97,13.36 18.77,13.36 18.69,13.44 | 16.2,19.89 16.2,19.79 16.84,19.15 16.82,19.13 | 16.84,19.02 16.82,19.02
  Top 0.305: IC3.44 16.55,13.37 v16.82,13.64 | C16.1 13.36,13.36 v13.64,13.36
  Top 0.61: v23.34,32.92 23.84,33.41 C4.2 25.75,33.41 C12.2 v26.7,33.4 27.45,34.15 U8.5 27.45,37.93 J2.9 | R11.2 17.01,22.37 17.4,22.76 21.44,22.76 v21.69,23.01 | R9.2 16.99,21.77 R11.2 | C19.1 16.71,21.5 R11.2 | R7.1 16.55,19.87 R9.2 | R9.2 16.82,20.14 16.82,19.13 16.82,19.02 16.82,18.41 16.82,18.11 | 16.82,18.11 v16.82,13.64 | R10.2 16.68,17.98 16.82,18.11
  Bottom 0.254: v26.49,14.48 26.59,14.58 27,14.58 | 27,14.58 32.99,14.58 33.98,13.59 34.93,13.59 D2.4 | J7.4 27.01,14.57 27,14.58
  Bottom 0.305: CN2.1 13.95,1.36 13.56,1.75 13.56,6.12 11.89,7.8 11.89,11.4 13.64,13.16 v13.64,13.36
  Bottom 0.61: v16.82,13.64 v18.64,13.64 | v21.69,23.01 23.34,24.66 v23.34,32.92 | J3.3 34.27,33.05 27.05,33.05 v26.7,33.4
A0
  Top 0.254: J8.6 32.54,4.46 17.97,4.46 17.7,4.72 17.7,8.28 18.34,8.92 IC3.3
A1  (via drill 0.3)
  Top 0.254: J8.5 34.64,4.9 24.23,4.9 20.34,8.79 IC3.7 20.34,11.12 19.71,11.75 v19.59,11.75
  Bottom 0.254: C3.1 16.24,21.79 R14.2 16.29,19.3 20.04,15.55 20.04,12.2 v19.59,11.75 | 13.36,21.79 R13.1
  Bottom 0.406: C3.1 13.36,21.79
A2  (via drill 0.3)
  Top 0.254: J8.4 36.72,5.36 24.43,5.36 20.84,8.95 IC3.8 20.84,11.54 19.74,12.64 v19.36,12.64
  Bottom 0.254: R15.1 13.97,19.41 R16.2 C9.1 16.32,18.54 19.56,15.3 19.56,12.84 v19.36,12.64
A3
  Top 0.254: IC3.9 21.34,9.09 24.59,5.84 38.78,5.84 J8.3
A4
  Top 0.254: IC3.10 21.84,9.22 24.77,6.3 40.87,6.3 J8.2
A5  (via drill 0.3)
  Top 0.305: IC3.47 15.07,11.87 14.83,11.63 v14.83,10.67
  Bottom 0.254: J8.1 46.18,0.48 24.61,0.48 23.57,1.53 23.57,2.63 22.96,3.23 20.85,3.23
  Bottom 0.305: 20.85,3.23 20.49,3.23 14.83,8.89 v14.83,10.67
AREFA
  Top 0.254: IC3.4 18.84,8.55 18.59,8.31 C22.1
BT_ANT
  Top 0.61: U1.20_ 52.82,24.86 arc-90 53.72,23.95 53.72,12.57 arc90 C30.2 53.74,11.21 arc90 R26.1
D0  (via drill 0.3)
  Top 0.254: IC3.16 25.84,12.87 v26.01,12.7 | R34.1 36.08,10.12 35.66,9.7 v35.66,8.94
  Bottom 0.254: v26.01,12.7 25.04,12.7 24.54,12.19 24.54,10.85 26.01,9.37 32.46,9.37 32.89,8.94 v35.66,8.94
D1  (via drill 0.3)  (1 unrouted)
  Top 0.254: IC3.15 25.27,12.37 v25.81,11.84 | R27.1 37.39,8.94 v36.68,8.94
  Bottom 0.254: 25.86,11.79 25.53,11.79 25.17,11.43 25.17,10.95 26.21,9.91 32.72,9.91 32.94,9.68 35.94,9.68 v36.68,8.94
D2  (via drill 0.3)
  Top 0.254: IC3.23 23.61,16.37 23.47,16.51 23.47,18.8 v23.71,19.04 | J2.1 44.45,34.75 v42.67,34.75
  Bottom 0.254: v23.71,19.04 23.72,19.05 23.98,19.05 26.47,21.54 26.47,30.2 27.53,31.27 39.88,31.27 42.67,34.06 v42.67,34.75
D3  (via drill 0.3)
  Top 0.254: IC3.14 | IC3.14 24.91,11.87 25.17,11.61 25.17,11.28 25.4,11.05 26.2,11.05 v26.21,11.06 | R42.1 45.65,11.46 v46.38,11.46
  Bottom 0.254: v26.21,11.06 26.21,10.9 26.72,10.39 32.94,10.39 33.12,10.21 36.52,10.21 37.47,11.15 45.82,11.15 46.1,11.43 46.13,11.46 | J2.2 44.12,36.96 44.12,25.12 45.7,23.55 51.44,23.55 52.65,22.33 52.65,17.98 46.13,11.46 | v46.38,11.46 46.13,11.46
D4  (via drill 0.3)
  Top 0.254: IC3.13 24.37,10.79 24.87,10.29 26.64,10.29 27.05,10.69 27.05,12.01 v26.8,12.27
  Bottom 0.254: v26.8,12.27 26.9,12.37 J7.2 33.2,12.37 34.49,11.07 36.27,11.07 36.3,11.1 36.42,11.23 | J2.3 43.51,37.11 43.51,24.92 45.39,23.04 51.18,23.04 52.15,22.07 52.15,18.31 45.62,11.79 36.96,11.79 | D2.1 36.42,11.79 36.96,11.79 | 36.42,11.23 36.96,11.76 36.96,11.79 | 36.42,11.89 36.42,11.23 | 36.42,11.23 36.55,11.35 36.55,11.71
D5  (via drill 0.3)
  Top 0.254: IC3.24 24.64,17.15 R18.1 24.64,21.5 v24.2,21.93
  Bottom 0.254: J2.4 38,35.92 27.62,35.92 25.02,33.31 25.02,22.75 v24.2,21.93
D6  (via drill 0.3)
  Top 0.254: IC3.29 20.84,19.09 21.36,19.61 21.36,20.3 24.03,22.97 v24.03,22.98
  Bottom 0.254: J2.5 35.9,36.36 26.94,36.36 24.54,33.96 24.54,23.49 v24.03,22.98
D7  (via drill 0.3)
  Top 0.254: IC3.30 20.34,19.32 20.8,19.79 20.8,20.75 v23.06,23
  Bottom 0.254: J2.6 33.78,36.78 26.49,36.78 24.05,34.34 24.05,24 v23.06,23
D8  (via drill 0.3)
  Top 0.254: IC3.11 22.34,11.62 22.78,12.06 v22.81,12.06 | 32.08,37.62 J2.7 31.62,37.16 v31.62,30.56
  Bottom 0.254: v22.81,12.06 22.81,17.07 26.95,21.21 26.95,29.74 27.94,30.73 31.45,30.73 v31.62,30.56
D9  (via drill 0.3)
  Top 0.254: IC3.12 22.84,10.73 v23.09,10.97 | J2.8 30.86,37.06 v30.86,30.1
  Bottom 0.254: v23.09,10.97 23.5,11.38 23.5,16.94 27.43,20.88 27.43,29.13 28.4,30.1 v30.86,30.1
  Bottom 0.406: R1.1 30.86,29.3 v30.86,30.1
D10  (via drill 0.3)
  Top 0.254: IC3.27 | IC3.27 | IC3.27 21.84,17.32 v21.5,16.97
  Bottom 0.254: v21.5,16.97 21.5,9.82 21.72,9.6 23.55,9.6 29.03,4.12 30.34,4.12 J8.7
D11  (via drill 0.3)
  Top 0.254: IC3.25 22.84,16.17 v22.16,15.48 | v32.08,3.4 31.32,3.4 J8.8
  Bottom 0.254: v22.16,15.48 22.16,10.46 22.5,10.11 23.75,10.11 29.16,4.7 30.79,4.7 v32.08,3.4
D12  (via drill 0.3)
  Top 0.254: IC3.28 21.34,17.82 v20.45,16.93
  Bottom 0.254: J8.9 27.38,5.06 23.32,9.12 21.36,9.12 21.01,9.47 21.01,16.37 v20.45,16.93
D13  (via drill 0.3)
  Top 0.254: IC3.26 22.34,16.55 22.05,16.26 20.04,16.26 19.53,16.77 v19.53,17.28
  Bottom 0.254: J8.10 24.84,6.38 24.84,6.91 23.11,8.64 21.11,8.64 20.55,9.2 20.55,15.75 19.53,16.77 v19.53,17.28
D+
  Top 0.254: IC3.34 18.34,18.44 | IC3.34 | R40.1 15.53,9.81 17.5,11.79 17.5,16.09 18.34,16.93 IC3.34
D-
  Top 0.254: IC3.33 18.85,16.7 17.98,15.83 17.98,11.53 15.72,9.27 11.05,9.27 R41.1
GND  (via drill 0.3)
  Top 0.254: CN2.3 CN2.5 17.14,0.94 17.65,0.43 19.51,0.43 19.68,0.61 CN2.9 | 18.36,19.31 18.21,19.31 17.84,18.93 IC3.35 | IC3.18 21.56,13.87 20.55,14.88 | IC3.42 14.69,14.37 13.31,15.75 13.31,16.54 C15.2 | IC3.5 19.34,8.27 19.48,8.13 19.48,5.54 | U1.27_ 43.84,30.3 43.66,30.48 43.66,32.11 43.94,32.38 46,32.38 v46.04,32.35
  Bottom 0.254: 32.74,18.57 35.1,18.57 35.56,19.02 D5.2
  other vias: 22.03,29.1 1.34,15.35 7.57,14.47 19.48,5.61 8.3,1.08 9.98,1.13 7.52,4.8 4.81,2.68 4.73,1.57 10.18,3.32 11.2,4.25 22.17,5.85 10.14,12.06 3.75,12.95 3.73,36.46 23.58,36.16 46.9,35.26 28.7,28.36 41.48,36.39 0.88,23.46 49.98,8.79 39.84,28.02 30.39,22.77 53.53,30.01 51.06,26.57 19.67,35.1 44.88,34.08 49.86,38.11 54.29,35.96 51.08,36.13 50.49,36.99 50.76,30.81 50.88,27.95 37.62,25.95 29.21,22.91 35.3,12.7 36.71,27.86 48.08,25.49 33.74,28.45 40.08,30.47 41.09,27.38 41.6,18.24 36.3,7.23 18.78,14.87 44.89,12.55 3.28,6.62 3.21,14.5 1.2,6.89 1.42,17.25 53.89,4.42 2.81,9.77 48.65,32.47 35.48,29.82 49.55,10.71 28.41,35.16 17.88,19.27 20.78,1.76 49.32,7.07 40.12,7.26 43.29,8.13 45.93,4.68 1.86,30.43 4.12,39.19 1.36,12.22 27.07,8.03 52.54,13.9 1.06,4.44 11.92,5.22 24.71,36.45 3.44,4.1 11.41,6.5 4.68,18.78 15.96,35.48 2.42,8.1 23.93,3.52 22.72,5.28 0.84,30.39 1.22,9.97 0.64,36.14 8.7,16.01 11.4,12.39 23.5,39.42 26.08,39.29 28.61,39.26 31.24,39.27 33.73,39.27 36.37,39.25 38.85,39.26 41.39,39.29 43.89,39.26 46.26,39.29 50.92,39.22 49.61,35.78 48.34,35.48 34.28,30.13 36.1,12.71 49.11,5.62 48.17,8.57 44.83,6.86 47.97,10.51 42.27,6.88 28.25,20.23 51.16,12.8 38.31,7.26 44.98,18.4 44.92,14.78 43.86,23 50.34,11.86 52.63,15.31 33.29,23.2 52.2,29.5 41.58,23.84 49.8,32 53.4,28.41 50.58,0.9 50.29,1.68 51.16,3.52 50.32,2.81 35.63,16.34 47.01,7.37 26.61,16.63 46.15,8.33 3.17,11.71 8.55,3.2 9.51,2.21
  pour Bottom (isolate 0.305, rank 6): -1.27,-1.27 60,-1.27 60,45 -1.27,45
  pour Top (isolate 0.305, rank 6): -1.27,-1.27 60,-1.27 60,45 -1.27,45
GPS_ANT  (2 unrouted)
  Top 0.406: 37.01,17.35 36.98,17.32 36.98,16.36 arc-97 35.74,14.96 arc90 34.29,13.51 34.29,11.51 arc-90 33.11,10.33 GPS.D 32.88,10.33 32.61,10.59 30.25,10.59 29.54,11.3 29.54,12.55
GPS_EN_  (via drill 0.3)
  Top 0.254: R28.1 31.41,17.98 v32.31,17.98 | v46.99,15.04 v50.83,15.04
  Top 0.406: v46.79,26.42 U1.59_
  Bottom 0.254: v32.31,17.98 32.31,17.73 34.52,15.52 46.51,15.52 v46.99,15.04 | v50.83,15.04 53.24,17.45 53.24,22.53 51.66,24.11 47.9,24.11 46.79,25.22 v46.79,26.42
  Bottom 0.406: v46.79,26.42 46.79,29.35 R32.1
GPS_RXD
  Top 0.254: U1.22_ 49.33,29.4 49.33,28.47 49.12,28.27 43.76,28.27 42.59,27.09 U1.62_
GPS_TXD
  Top 0.254: U1.61_ 43.99,27.4 44.4,27.81 49.61,27.81 50.14,28.35 50.14,30.18 49.71,30.61 48.46,30.61 48.24,30.38 U1.23_
GSM_ANT
  Top 0.61: U1.32_ 38.34,31.71 arc-90 39.75,33.12 45.3,33.12 arc90 C18.2 47.1,33.64 arc90 R6.1
GSM_DTR  (via drill 0.3)
  Top 0.254: v26.16,18.29 R18.2 | U1.6_ 42.74,10.4 v42.85,10.29 43.31,9.83 R29.2
  Bottom 0.254: v26.16,18.29 25.96,18.29 23.98,16.31 23.98,10.62 25.73,8.87 32.11,8.87 32.84,8.13 37.19,8.13 39.5,10.44 42.7,10.44 v42.85,10.29
GSM_RI
  Top 0.254: U1.7_ 43.84,11.66 R42.2
MISO  (via drill 0.3)  (1 unrouted)
  Top 0.254: IC3.21 24.9,15.37 25.2,15.67 25.2,16.31 v25.43,16.54
  Bottom 0.254: 27.28,17.88 27.28,17.83 27.33,17.88 27.47,17.74 | 27.26,17.86 26.75,17.86 v25.43,16.54 | 27.47,17.74 27.56,17.65 31.55,17.65 34.31,14.88 35.99,14.88 36.42,14.45 36.42,13.61 D2.6 | J7.7 27.59,17.87 27.47,17.74
MOSI  (via drill 0.3)
  Top 0.254: IC3.19 25.34,14.37 v25.47,14.24
  Bottom 0.254: 27.27,13.47 27.46,13.47 | 27.27,13.47 | 27.27,13.47 26.24,13.47 v25.47,14.24 | 27.46,13.47 33.27,13.47 D2.3 | J7.3 27.46,13.47
N$1
  Top 0.254: NET.+ 31.24,14.8 R4.2
N$2
  Bottom 0.406: R5.2 1PPS.+
N$3
  Top 0.61: R7.2 12.26,19.87 PWR.+
N$4  (via drill 0.3)
  Top 0.254: U1.64_ v36.12,22.96
  Bottom 0.254: v36.12,22.96 36.12,24.63 R31.1
N$5
  Top 0.406: IC1.P$1 7.16,32.36 7.75,31.77 7.75,29.28 C21.1 10.12,29.26 D3.C 10.14,28.16 11.3,27 14.06,27 L2.1
  pour Top: 5.82,33.22 8.48,33.22 11.13,30.58 11.13,28.68 11.63,28.17 17.73,28.17 17.73,25.12 11.73,25.12 11.73,26.42 11.35,26.8 10.16,26.8 8.23,28.73 7.24,28.73 7.24,30.86 6.55,31.55 5.92,31.55 5.82,31.55
N$6
  Top 0.61: IC1.P$8 6.99,26.96 C21.2
  pour Top: 6.05,26.14 7.16,26.14 8.23,27.2 8.23,27.91 8,28.14 6.99,28.14 6.55,27.71 6.07,27.71 6.05,27.71
N$7
  Top 0.254: STA.+ R3.2
N$8  (via drill 0.3)
  Top 0.61: R25.2 22.15,31.83 | 22.15,31.83 C20.2 | 22.15,31.83 22.3,31.98 v22.3,32.66
  Bottom 0.254: IC2.4 20.84,32.22
  Bottom 0.61: IC2.4 21.85,32.22 v22.3,32.66 22.43,32.79 CHG.+
N$9
  Top 0.254: 2.1,32.6 2.07,32.56 1.93,32.56
  Top 0.406: IC1.P$4 2.1,32.6 R22.2 | 1.14,33.05 2.44,33.05 2.44,31.98 1.83,31.98 1.4,32.41 1.4,32.61 1.57,32.79 1.93,32.79 1.93,32.56 1.93,32.21 | 1.93,32.08 1.93,32.21 | 1.93,32.21 1.68,32.46
  Top 0.813: R24.1 8.99,34.29 5.87,34.29 4.98,35.18 2.46,35.18 1,33.72 R22.2
N$10  (via drill 0.3)
  Top 0.406: IC1.P$3 3.61,33.09 v2.87,33.83
  Bottom 0.406: C24.1 2.84,33.8 v2.87,33.83 C23.2
N$11
  Bottom 0.406: R20.2 1.38,34.71 C23.1
N$12
  Top 0.254: R26.2 C29.2 BT.D
N$13
  Top 0.406: IC1.P$6 3.61,25.73 3.15,25.27 1.52,25.27 0.99,25.81 R21.2
N$14  (via drill 0.3)
  Top 0.406: IC1.P$2 4.88,33.17 v3.94,34.11
  Bottom 0.406: v3.94,34.11 3.94,30.7 R23.2 2.64,29.16 1.93,28.45 R19.1
N$16  (via drill 0.3)
  Top 0.254: U1.65_ 36.94,21.51 v36.2,21.51
  Bottom 0.254: R30.1 36.19,21.5 v36.2,21.51
N$17
  Top 0.254: U1.2_ 38.34,11.87 R27.2 R33.2
N$18
  Top 0.254: U1.1_ 37.24,11.81 R34.2
N$19  (via drill 0.3)
  Top 0.406: U1.57_ v49.59,26.74 v49.58,26.75
  Bottom 0.406: R32.2 48.54,27.79 v49.58,26.75
N$20
  Top 0.406: U1.24_ VUSB.T arc-90 VUSB.T
N$21
  Top 0.406: L1.1 C7.2 | C7.2 29.52,17.85
  Top 0.61: C7.2 | 29.52,17.85 R8.2
N$22
  Top 0.406: U1.25_ DP.T arc90 DP.T
N$23
  Top 0.406: U1.26_ 44.94,31.17 DN.T
N$24
  Top 0.61: U8.3 29.35,30.43 R37.2
N$25
  Bottom 0.406: R38.1 22.4,35.36 CHG.-
N$26
  Bottom 0.61: IC2.1 19.12,30.32 19.41,30.61 19.41,33.27 19.96,33.83 R38.2
N$27
  Top 0.254: USB.A5 7.95,10.67 R36.2
N$28
  Top 0.254: USB.B5 7.55,7.67 7.82,7.39 9.3,7.39 R35.2
N$29
  Top 0.406: U1.28_ 42.74,31.53 arc90 C46.1
N$31
  Bottom 0.61: IC2.5 20.71,29.77 R39.1
N$32  (via drill 0.3)
  Top 0.254: R40.2 8.46,9.67 USB.A6 4.91,9.67 v4.67,9.91 | v4.67,8.31 5.03,8.67 USB.B6
  Bottom 0.254: v4.67,9.91 v4.67,8.31
N$33
  Top 0.254: R41.2 7.77,9.17 USB.A7 4.27,9.17 3.96,9.47 3.96,10.29 4.27,10.59 4.93,10.59 5.35,10.17 USB.B7
N$36
  Bottom 0.406: Q2.1 30.75,27.55 R1.2 R2.1
N$94
  Top 0.61: R6.2 49.87,33.66 arc-90 C17.2 arc-90 49.9,33.65 GSM.D
NETLIGHT
  Top 0.254: R4.1 32.22,17.3 32.84,17.3 33.8,18.26 U1.41_
P$1
  Bottom 0.254: R30.2 34.62,24.61 R31.2
PA00_XIN32
  Top 0.254: IC3.1 15.46,7.96 X2.P$2 C13.1
PA01_XOUT32
  Top 0.254: IC3.2 17.84,9.23 16.82,8.2 C14.1 15.35,5.56 X2.P$1
PWRKEY  (via drill 0.3)
  Top 0.254: U1.39_ 33.03,20.46 32.22,21.27 PWKEY.2 v32.21,22.95
  Bottom 0.254: Q2.3 32.21,23.29 v32.21,22.95
RESET  (via drill 0.3)
  Top 0.254: IC3.40 14.84,15.37 v14.56,15.65 14.23,15.98 R10.1
  Bottom 0.254: RESET.P$1 12.06,2.06 13.69,0.43 20.73,0.43 J8.11 | CN2.10 19.68,3.05 14.1,8.64 14.1,10.97 14.56,11.43 v14.56,15.65 v14.55,15.65
  Bottom 0.305: CN2.10 21.66,2.63 J8.11
SCK  (via drill 0.3)  (1 unrouted)
  Top 0.254: IC3.20 25.13,14.87 v25.96,15.7
  Bottom 0.254: 27.25,15.65 26.01,15.65 v25.96,15.7 | 27.27,15.67 27.38,15.67 | 27.38,15.67 32.77,15.67 34.11,14.33 35.51,14.33 35.69,14.15 D2.5 | J7.5 27.39,15.67 27.38,15.67
SCL  (via drill 0.3)  (1 unrouted)
  Top 0.254: IC3.32 19.34,20.12 | 19.34,20.12 19.34,20.57 v19.27,20.64 | R9.1 19.15,20.31 19.34,20.12 | 18.49,20.3 18.67,20.3 19.15,20.78 19.15,20.02 | 19.15,20.02 19.33,19.84 | 19.15,20.02 18.95,20.22 18.95,20.5
  Bottom 0.254: v19.27,20.64 19.4,20.78 20.42,20.78 20.85,20.34 23.65,20.34 25.5,22.2 25.5,30.96 26.87,32.33 36.1,32.33 J3.2
SDA  (via drill 0.3)
  Top 0.254: IC3.31 19.84,19.91 v20.01,20.08 v20.02,20.08 20.02,21.34 19.56,21.79 R11.1
  Bottom 0.254: v20.01,20.08 20.23,19.86 24,19.86 25.98,21.84 25.98,30.63 27.15,31.8 38.11,31.8 J3.1
SIM_CLK  (via drill 0.3)
  Top 0.254: U1.16_ 51.29,20.46 v50.8,19.96
  Bottom 0.254: D5.4 36.68,17.31 U4.3 38.88,17.31 41.53,19.96 v50.8,19.96
SIM_DATA  (via drill 0.3)
  Top 0.254: U1.15_ 51.13,19.36 v50.8,19.02
  Bottom 0.254: D5.5 35.56,18.21 35.93,18.58 U4.7 38.98,18.58 41.07,20.68 51.26,20.68 51.56,20.37 51.56,19.56 51.03,19.02 v50.8,19.02
SIM_RST  (via drill 0.3)
  Top 0.254: U1.17_ 51.05,21.56 v50.83,21.34
  Bottom 0.254: D5.3 36.68,19.85 U4.2 39.36,19.85 40.87,21.36 50.8,21.36 v50.83,21.34
SIM_VDD  (via drill 0.3)
  Top 0.254: U1.18_ 52.06,22.63 51.1,22.63 v50.77,22.3
  Bottom 0.254: D5.1 34.81,19.98 35.08,20.24 36.27,20.24 36.93,20.9 36.93,22.25 37.06,22.38 38.23,22.38 U4.1 | 38.25,22.4 U4.1 | U4.1 38.33,22.3 | v50.77,22.3 50.55,22.07 38.56,22.07 U4.1
STATUS
  Top 0.254: U1.42_ 33.55,17.16 R3.1
SWCLK  (via drill 0.3)
  Top 0.254: IC3.45
  Top 0.305: IC3.45 14.4,12.87 v13.41,11.89
  Bottom 0.254: CN2.4 15.88,5.84 13.41,8.31 v13.41,11.89
SWDIO  (via drill 0.3)
  Top 0.254: IC3.46
  Top 0.305: IC3.46 14.71,12.37 14.15,11.81 14.15,11.33 13.87,11.05 v12.67,11.05
  Bottom 0.254: CN2.2 14.61,6.27 12.67,8.21 v12.67,11.05
VBAT
  Bottom 0.254: IC2.3 18.11,33.41 J6.1
  Bottom 0.406: SW1.COM1 10.48,37.41 18.03,37.41 | 18.03,37.41 21.71,37.41 J2.11 | 18.11,33.41 18.11,37.34 18.03,37.41
  pour Bottom (rank 4): 18.72,32.03 18.72,35.89 19.74,36.91 22.58,36.91 23.19,37.52 23.19,38.46 22.63,39.01 21.74,39.01 21.03,38.3 20.75,38.02 10.36,38.02 9.73,38.02 8.59,36.88 8.56,36.86 8.56,35.64 8.81,35.38 9.65,35.38 11.18,36.91 16.51,36.91 17.12,36.3 17.12,32.11 17.12,32.03
VBAT_IN  (via drill 0.3)
  Top 1.27: D7.A 18.12,24.03 12.65,24.03 v12.14,23.52
  Bottom 0.406: SW1.CH1A 6.51,31.82 Q1.3 7.08,28.23 11.79,23.52 13.16,23.52 R13.2
  other vias: 12.42,24.16
  pour Bottom: 5.56,36.58 5.56,28.68 11.25,22.99 13.77,22.99 13.77,24.41 11.66,24.41 7.75,28.32 7.75,31.85 6.96,32.64 6.96,36.53 6.96,36.58
VBUS  (via drill 0.3)
  Top 0.406: IC1.P$7 4.88,24.16 v5,24.05 J1.3
  Bottom 0.406: R19.2 3.45,26.38 | 3.45,26.38 C33.1 | v5,24.05 4.29,24.75 C28.1 3.45,24.86 3.45,26.38
  Bottom 1.778: D1.C 9.58,18.18 8.13,19.63 J1.3
  other vias: 4.95,25.11
  pour Top (rank 4): 4.34,27.76 4.34,21.77 7.52,18.59 8.92,18.59 9.45,19.13 9.45,22.33 8.36,23.42 6.68,23.42 5.56,24.54 5.56,27.71 5.56,27.76
  pour Bottom: 2.74,28.24 2.74,24.26 3.35,23.65 5.38,23.65 5.38,26.21 4.09,27.51 4.09,28.24
VDD
  Top 0.406: SW1.COM2 10.62,37.47 12.85,37.47 13.61,36.7 13.61,32.82 | 13.61,32.82 13.61,31.74 L2.2 15.07,30.29 C27.2 | R24.2 13.5,32.93 13.61,32.82 | C25.2 C26.2 C27.2 | C27.2 | C27.2 18.94,31.81 R25.1
  pour Top (rank 4): 19.46,26.75 19.46,32.44 15.24,32.44 14.66,33.02 14.66,37.26 13.79,38.13 10.92,38.13 9.42,39.62 8.59,39.62 8.2,39.24 8.2,38.51 9.73,36.98 12.29,36.98 12.65,36.63 12.65,34.92 11.68,33.73 11.68,29.21 17.7,29.21 18.19,28.73 18.19,26.72 19.43,26.72
VDD_EXT_2V8
  Top 0.406: R8.1 31.26,19.39 | U1.40_ 31.29,19.36
  Top 0.61: 31.26,19.39 R28.2 31.29,19.36
VDDCORE
  Top 0.254: C15.1 14.45,13.87 IC3.43
VIN  (via drill 0.3)
  Top 0.254: U1.35_ 34.49,25.45 | 34.49,25.45 U1.34_ | 34.49,25.45 34.17,25.14 C10.A 31.53,25.46 C2.2 28.02,25.46 C35.2 26.53,25.49 C31.2 | C31.2 26.69,25.65 C44.P$1 26.58,28.09 25.63,28.09 | C31.2 24.97,25.44 R17.2 | D6.C 25.63,28.09 | C8.2 25.66,28.12 25.63,28.09 | C8.2 C5.2 | R37.1 25.72,30.05 C8.2
  Top 0.61: D7.C 23.61,25.46 R17.2 | U8.1 R37.1
  Bottom 0.254: D4.C 13.05,27.09 C11.2 14.69,27.07 C1.2
  Bottom 0.406: Q1.2 11.37,28.11 D4.C
  other vias: 21.36,25.58 20.9,26.01
  pour Top: 35.31,24.38 30.58,24.38 30.15,24.82 24.46,24.82 24.13,24.49 24.13,23.67 20.7,23.67 20.7,26.21 22.02,26.21 24.99,29.18 24.99,32.13 27.69,32.13 27.69,27.48 28.32,26.85 35.31,26.85
  pour Bottom: 8.69,30.63 8.69,28.96 12.27,25.37 21.59,25.37 21.59,26.8 17.7,26.8 16.89,27.61 13.16,27.61 10.13,30.63
VSYS
  Bottom 0.813: 7.77,37.31 7.77,33.6 Q1.1 11.98,32.2 D4.A 14.36,32.16 R12.1 | 7.77,37.31 7.77,37.77 SW1.CH2A 4.9,37.42 4.9,28.19 11.56,21.53 R15.2 | 5.36,37.82 7.26,37.82 | 7.26,37.82 7.77,37.31 | 7.26,37.82 6.78,38.3 6.22,38.3
VUSB  (via drill 0.3)
  Top 0.254: USB.VBUS1 7.46,11.87 7.47,11.87 v7.47,12.06
  Top 0.61: USB.VBUS2 7.03,6.97 7.53,6.46 C34.1 7.48,6.46 v7.47,6.48 | USB.VBUS1 7.24,11.87 8.21,12.83 C32.1
  Bottom 0.813: v7.47,6.48 v7.47,12.06 9.54,14.13 D1.A

### Text on the board
tPlace: VBAT | GND | 3V3 | D9 | D8 | D7 | D6 | D5 | D4 | D3 | D2 | VBAT | + | SCL | SDA | - | GND | 3V3 | SWD | D11 | A5 | RST | D13 | D12 | D10 | A0 | A1 | A2 | A3 | A4
tNames: ON | OFF
bNames: www.makerfabs.com | Maduino Zero | SIM868 GPS Tracker V1.1